# Altium schematic sheet MOTORS.SchDoc
size A4; SheetNumber: 7; SheetTotal: 7
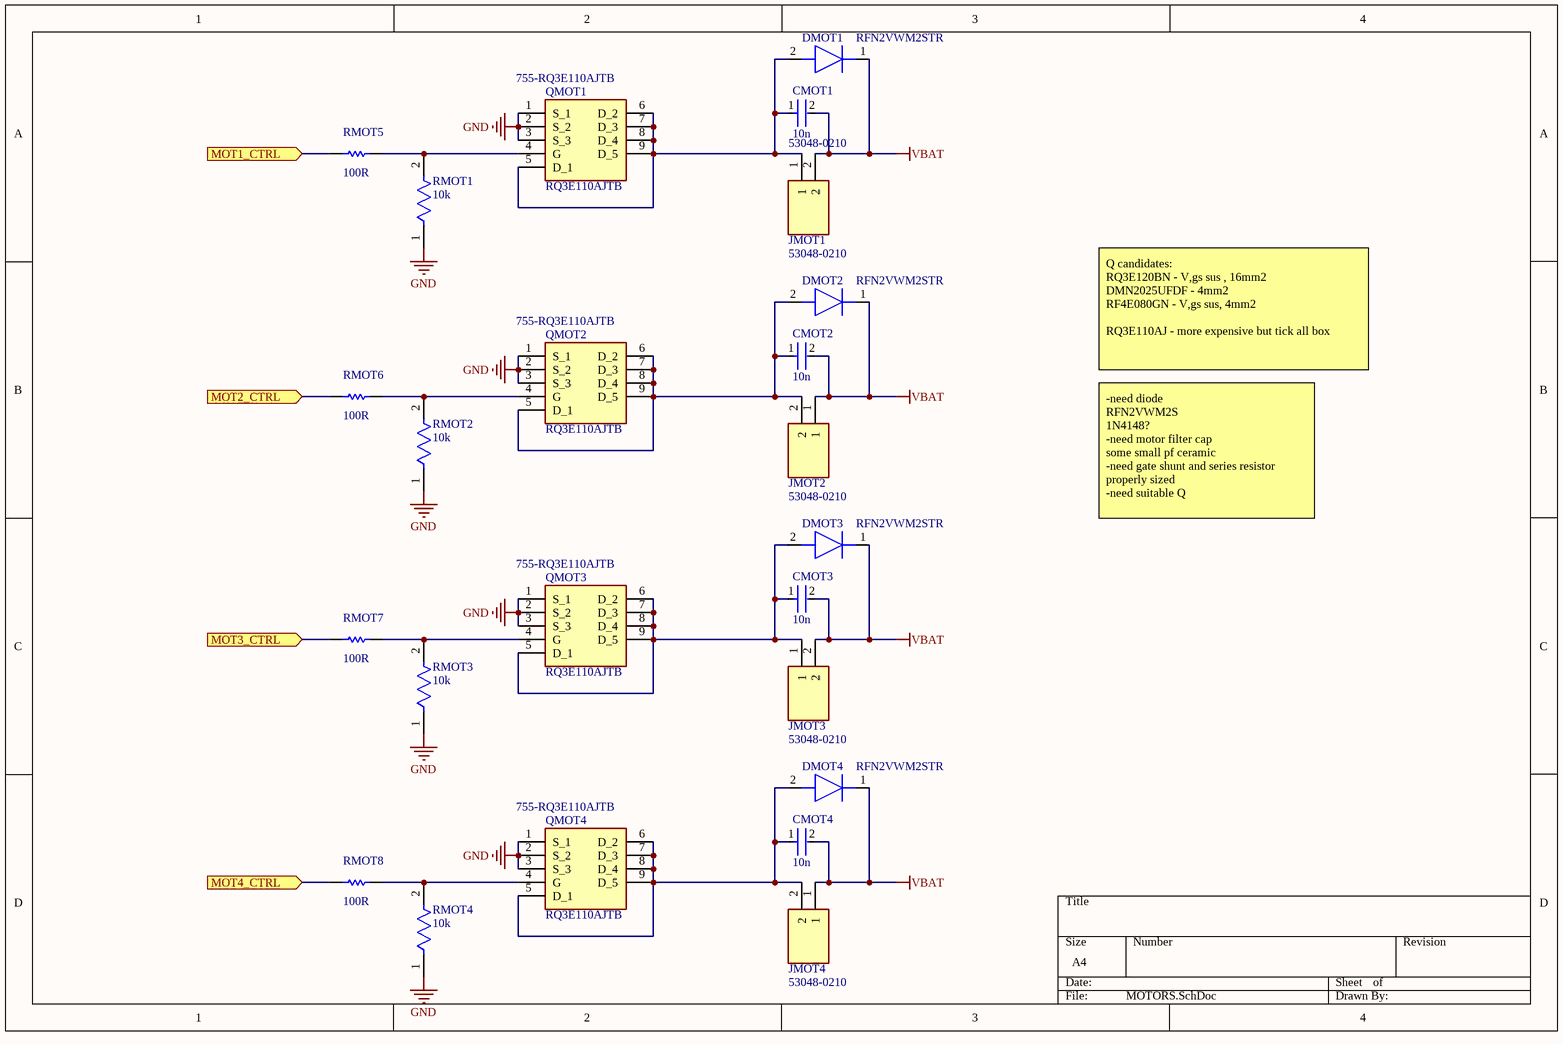
[diagram p0: MOTORS.SchDoc]

## Parts
CMOT1  10n  [FP-CL10-IPC_A]
CMOT2  10n  [FP-CL10-IPC_A]
CMOT3  10n  [FP-CL10-IPC_A]
CMOT4  10n  [FP-CL10-IPC_A]
DMOT1  RFN2VWM2STR  [RFN2VWM2STR]
DMOT2  RFN2VWM2STR  [RFN2VWM2STR]
DMOT3  RFN2VWM2STR  [RFN2VWM2STR]
DMOT4  RFN2VWM2STR  [RFN2VWM2STR]
JMOT1  53048-0210  [SHDRRA2W35P0X125_1X2_425X550X350P]
JMOT2  53048-0210  [SHDRRA2W35P0X125_1X2_425X550X350P]
JMOT3  53048-0210  [SHDRRA2W35P0X125_1X2_425X550X350P]
JMOT4  53048-0210  [SHDRRA2W35P0X125_1X2_425X550X350P]
QMOT1  RQ3E110AJTB  Supplier Part Number 1: 755-RQ3E110AJTB  [RQ3E110AJTB]
QMOT2  RQ3E110AJTB  Supplier Part Number 1: 755-RQ3E110AJTB  [RQ3E110AJTB]
QMOT3  RQ3E110AJTB  Supplier Part Number 1: 755-RQ3E110AJTB  [RQ3E110AJTB]
QMOT4  RQ3E110AJTB  Supplier Part Number 1: 755-RQ3E110AJTB  [RQ3E110AJTB]
RMOT1  10k  [FP-ERJ3G-IPC_C]
RMOT2  10k  [FP-ERJ3G-IPC_C]
RMOT3  10k  [FP-ERJ3G-IPC_C]
RMOT4  10k  [FP-ERJ3G-IPC_C]
RMOT5  100R  [RESC1608X55X30LL15T15]
RMOT6  100R  [RESC1608X55X30LL15T15]
RMOT7  100R  [RESC1608X55X30LL15T15]
RMOT8  100R  [RESC1608X55X30LL15T15]

## Ports
MOT1_CTRL (in), MOT2_CTRL (in), MOT3_CTRL (in), MOT4_CTRL (in)

## Nets
GND: QMOT1.1(S_1) QMOT1.2(S_2) QMOT1.3(S_3) QMOT2.1(S_1) QMOT2.2(S_2) QMOT2.3(S_3) QMOT3.1(S_1) QMOT3.2(S_2) QMOT3.3(S_3) QMOT4.1(S_1) QMOT4.2(S_2) QMOT4.3(S_3) RMOT1.1 RMOT2.1 RMOT3.1 RMOT4.1
VBAT: CMOT1.2 CMOT2.2 CMOT3.2 CMOT4.2 DMOT1.1(K) DMOT2.1(K) DMOT3.1(K) DMOT4.1(K) JMOT1.2 JMOT2.1 JMOT3.2 JMOT4.1
MOT1_CTRL: RMOT5.1 ; port MOT1_CTRL
MOT2_CTRL: RMOT6.1 ; port MOT2_CTRL
MOT3_CTRL: RMOT7.1 ; port MOT3_CTRL
MOT4_CTRL: RMOT8.1 ; port MOT4_CTRL
NetCMOT1_1: CMOT1.1 DMOT1.2(A) JMOT1.1 QMOT1.5(D_1) QMOT1.6(D_2) QMOT1.7(D_3) QMOT1.8(D_4) QMOT1.9(D_5)
NetCMOT2_1: CMOT2.1 DMOT2.2(A) JMOT2.2 QMOT2.5(D_1) QMOT2.6(D_2) QMOT2.7(D_3) QMOT2.8(D_4) QMOT2.9(D_5)
NetCMOT3_1: CMOT3.1 DMOT3.2(A) JMOT3.1 QMOT3.5(D_1) QMOT3.6(D_2) QMOT3.7(D_3) QMOT3.8(D_4) QMOT3.9(D_5)
NetCMOT4_1: CMOT4.1 DMOT4.2(A) JMOT4.2 QMOT4.5(D_1) QMOT4.6(D_2) QMOT4.7(D_3) QMOT4.8(D_4) QMOT4.9(D_5)
NetQMOT1_4: QMOT1.4(G) RMOT1.2 RMOT5.2
NetQMOT2_4: QMOT2.4(G) RMOT2.2 RMOT6.2
NetQMOT3_4: QMOT3.4(G) RMOT3.2 RMOT7.2
NetQMOT4_4: QMOT4.4(G) RMOT4.2 RMOT8.2

## Notes on the sheet
- Q candidates:
  RQ3E120BN - V,gs sus , 16mm2
  DMN2025UFDF - 4mm2
  RF4E080GN - V,gs sus, 4mm2
  RQ3E110AJ - more expensive but tick all box
- -need diode
  RFN2VWM2S
  1N4148?
  -need motor filter cap
  some small pf ceramic
  -need gate shunt and series resistor properly sized
  -need suitable Q

## Library data of the parts
CMOT1-CMOT4 = CMP-13271-001215-1: Cap Ceramic 10nF 50V X7R ±10% Pad SMD 0603 +125°C T/R; Dielectric: X7R; Features: Soft Termination; Packaging: Tape and Reel; Voltage Rating: 50V; Ratings: AEC-Q200; Radiation Hardening: No; Height: 0.8mm; Package Quantity: 4000; Case Code (Metric): 1608; Capacitance: 10nF; Length: 1.6mm; Width: 0.031inch; Case/Package: 0603; Thickness: 0.035inch; Tolerance: 10%; Max Operating Temperature: 125°C; Lead Free: Lead Free; Mount: Surface Mount; Min Operating Temperature: -55°C; Case Code (Imperial): 0603; Voltage: 50V; Depth: 0.8mm
DMOT1-DMOT4 = CMP-009-000000-1: Diodes - General Purpose; Manufacturer_Name: ROHM Semiconductor; Height: 1mm; Source: SamacSys.SchLib; Manufacturer_Part_Number: RFN2VWM2STR; Mouser Part Number: 755-RFN2VWM2STR; Design Item ID: RFN2VWM2STR; Datasheet Link: https://fscdn.rohm.com/en/products/databook/datasheet/discrete/diode/fast_recovery/rfn2vwm2str-e.pdf; Mouser Price/Stock: https://www.mouser.co.uk/ProductDetail/ROHM-Semiconductor/RFN2VWM2STR?qs=MyNHzdoqoQLG6Du3HymTWQ%3D%3D
JMOT1-JMOT4 = 53048-0210: Connector; Manufacturer_Name: Molex; Datasheet Link: https://www.molex.com/pdm_docs/sd/530481010_sd.pdf; Height: 3.5mm; Manufacturer_Part_Number: 53048-0210; Mouser Part Number: 538-53048-0210; Mouser Price/Stock: https://www.mouser.co.uk/ProductDetail/Molex/53048-0210?qs=o4r9IV%252BgZWMoVY43HmKPkg%3D%3D
  JMOT1: Supplier 1: Arrow Electronics; Supplier Part Number 1: 53048-0210
QMOT1-QMOT4 = RQ3E110AJTB: MOSFET (N-Channel); Manufacturer_Name: ROHM Semiconductor; Datasheet Link: https://fscdn.rohm.com/en/products/databook/datasheet/discrete/transistor/mosfet/rq3e110ajtb-e.pdf; Height: 0.95mm; Manufacturer_Part_Number: RQ3E110AJTB; Mouser Part Number: 755-RQ3E110AJTB; Mouser Price/Stock: https://www.mouser.co.uk/ProductDetail/ROHM-Semiconductor/RQ3E110AJTB/?qs=4v%252BiZTmLVHGt3DMv0H7VeQ%3D%3D; Supplier 1: Mouser
RMOT1-RMOT4 = CMP-2000-00704-2: RES SMD 10K OHM 5% 1/10W 0603; Temperature Coefficient: 200ppm/°C; Max Power Dissipation: 100mW; Resistance: 10kR; Voltage Rating (DC): 50V; Voltage Rating: 75V; Resistor Type: Thick Film; Tolerance: 5%; Military Standard: Not; Package Quantity: 1; Max Operating Temperature: 155°C; Mount: Surface Mount; Technology: THICK FILM; Case/Package: 0603; Construction: Rectangular; Depth: 0.8mm; Case Code (Imperial): 0603; Weight: 7.1E-05oz; Features: Automotive AEC-Q200; Packaging: Tape and Reel; Width: 0.8mm; Length: 1.6mm; Termination: SMD/SMT; Power Rating: 100mW; Lead Free: Lead Free; Number of Terminations: 2; Height: 0.45mm; RoHS Compliant: Yes; Min Operating Temperature: -55°C; Contact Plating: Tin; REACH SVHC: No SVHC; Resistance Tolerance: 5%; Series: ERJ; Working Voltage: 75V; Case Code (Metric): 1608
RMOT5-RMOT8 = CMP-2000-00179-1: Manufacturer: Panasonic; Part Number: ERJ-3EKF1000V